# EasyEDA Pro project ProPrj_tp4056 charger_2026-03-09.epro

# Schematic Schematic1
Board Name: Board1; Create Date: 2026-02-10; Page Name: P1; Project Name: tp4056 charger; Schematic Name: Schematic1; Update Date: 2026-02-09; Company: EasyEDA.com; Page Size: A4; Version: V1.0
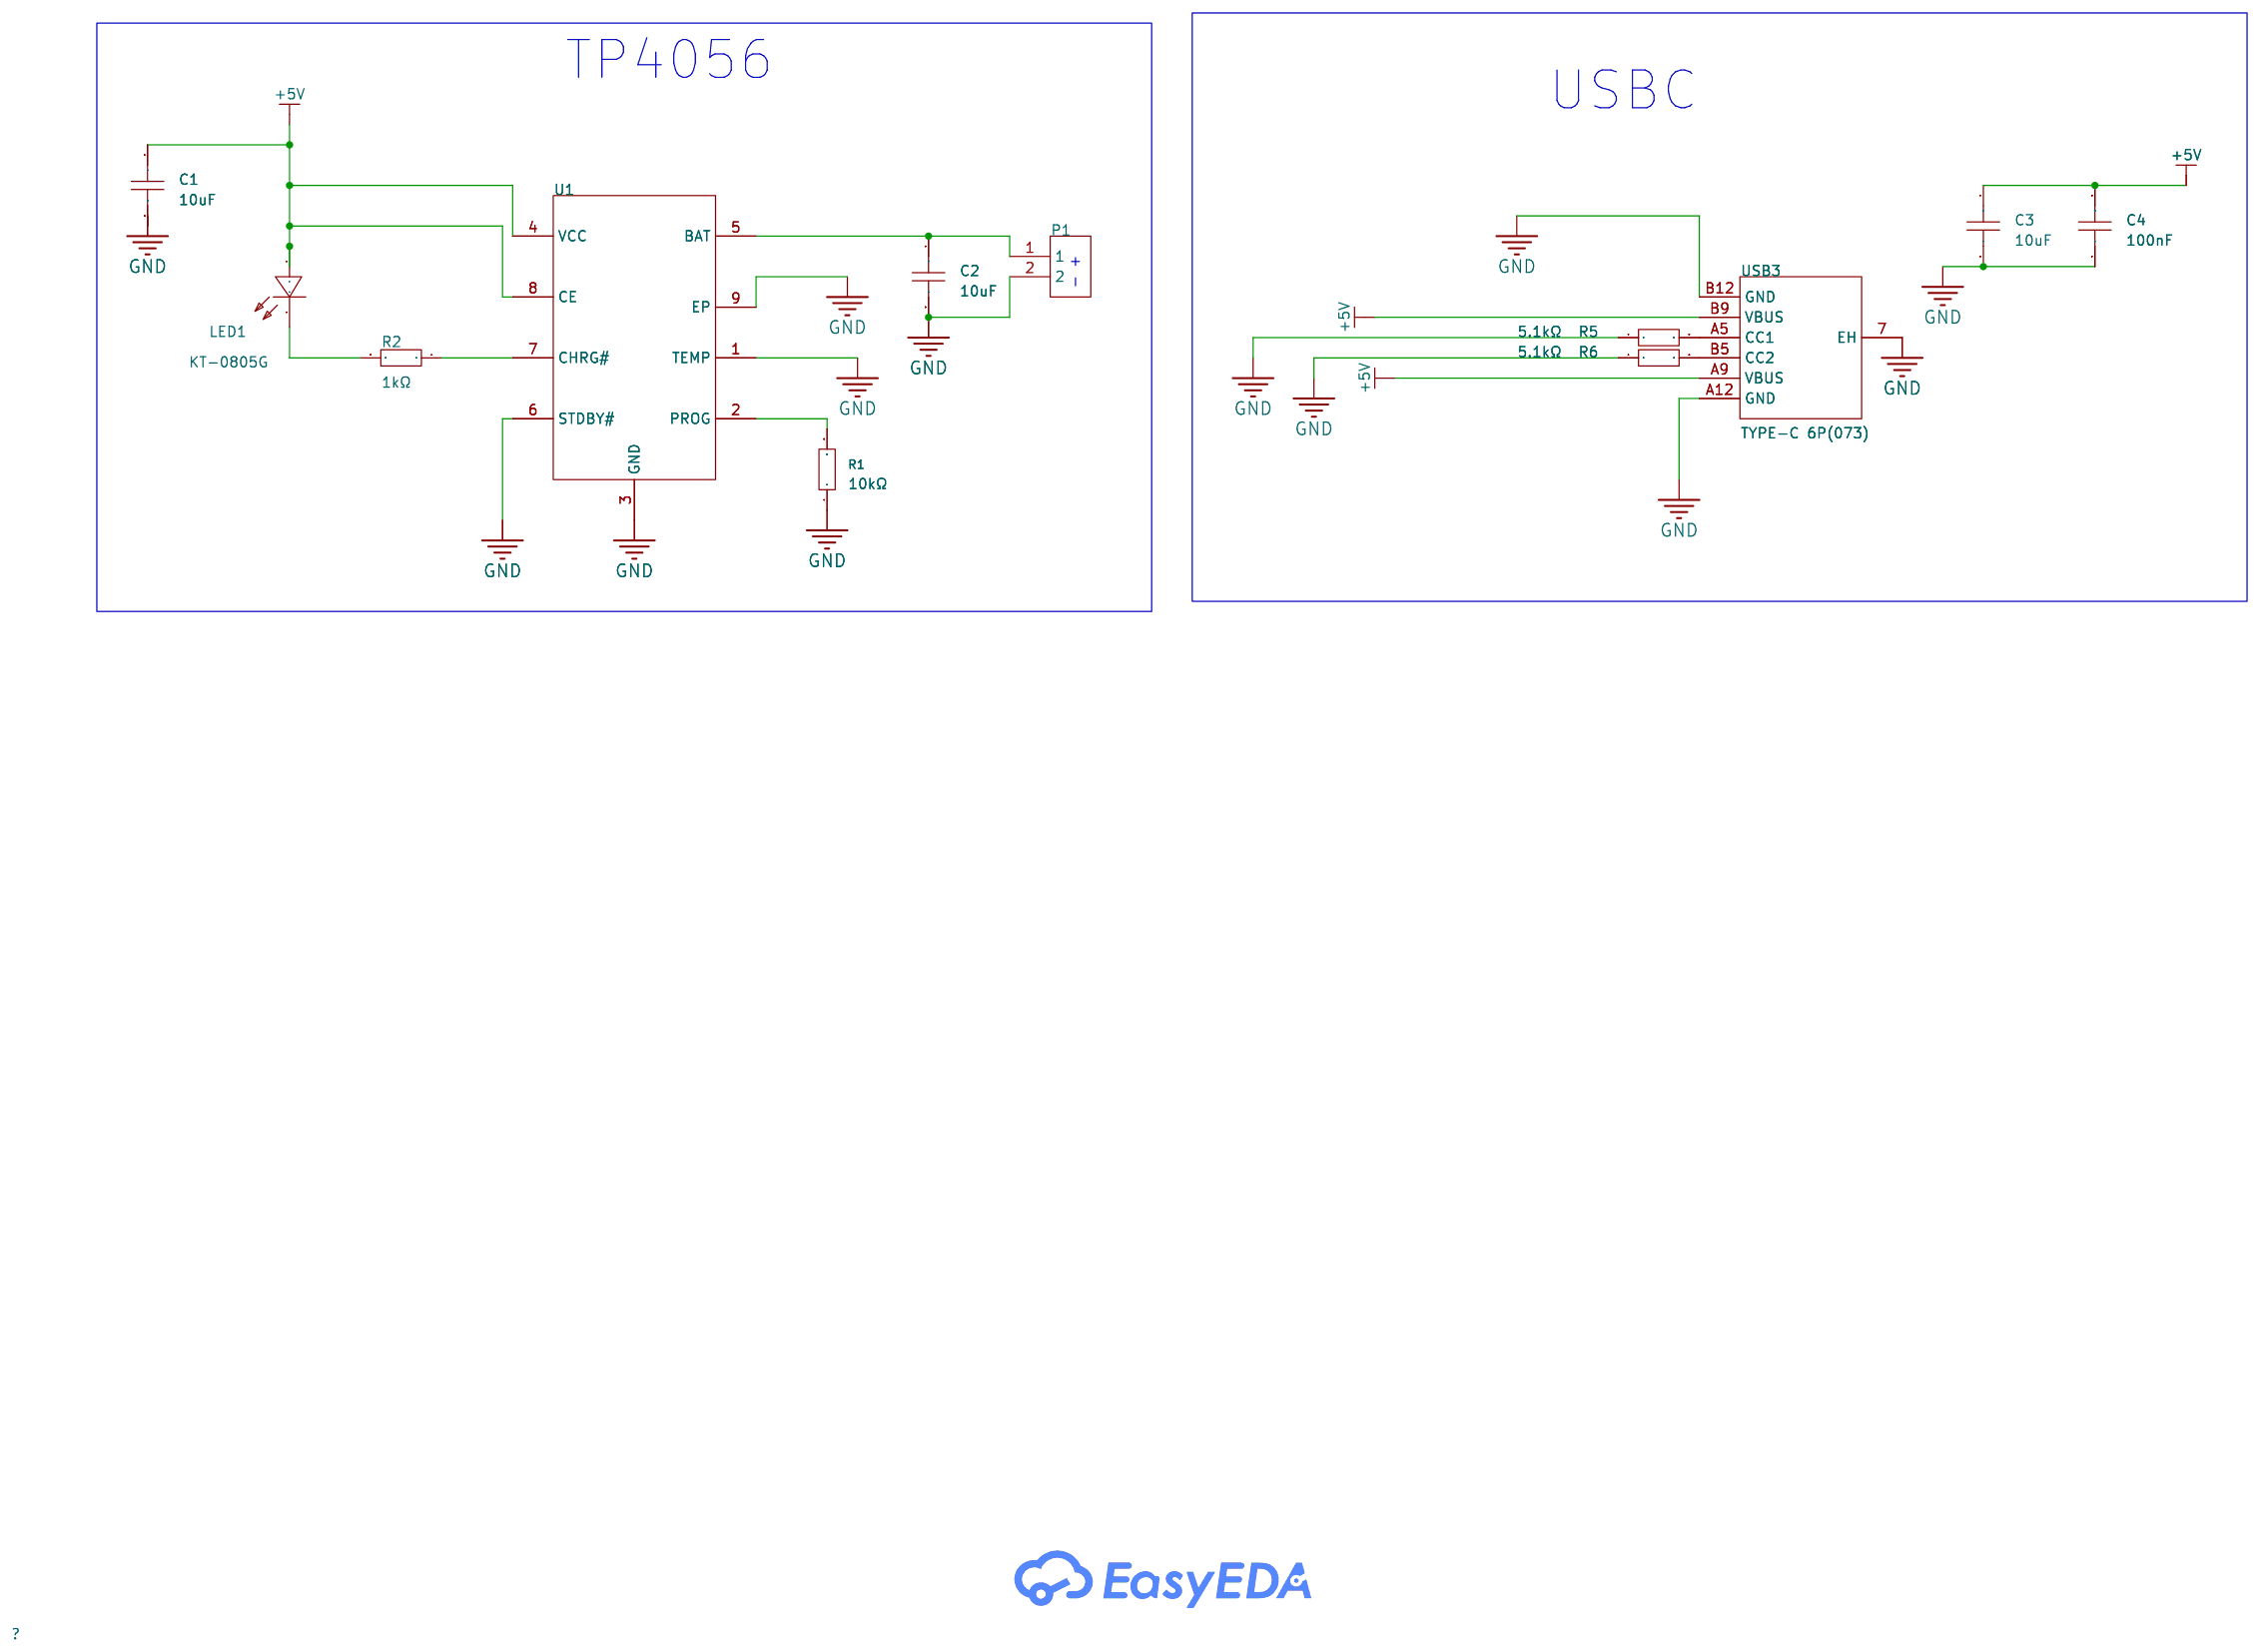
[diagram p0: schematic sheet]

## Parts
C1  10uF  [C0805]
C2  10uF  [C0805]
C3  10uF  [C0805]
C4  100nF  [C0402]
LED1  KT-0805G  [LED0805-R-RD]
P1  WJ301V-5.0-02P-12-00A  [CONN-TH_2P-P5.00_WJ301V-5.00-2P]
R1  10kΩ  [R1206]
R2  1kΩ  [R0402]
R5  5.1kΩ  [R0603]
R6  5.1kΩ  [R0603]
U1  TP4056-42-ESOP8  [ESOP-8_L4.9-W3.9-P1.27-LS6.0-BL-EP]
USB3  TYPE-C 6P(073)  [TYPE-C-SMD_TYPE-C-6P-073]

## Library data of the parts
C1-C3 = CL21A106KAYNNNE_C15850: Capacitance:10uF Tolerance:±10% Tolerance:±10% Voltage Rating:25V Temperature Coefficient:X5R; LCSC Part Name: 10uF ±10% 25V; Supplier Part: C15850; Manufacturer: SAMSUNG(三星); Manufacturer Part: CL21A106KAYNNNE; Supplier Footprint: 0805; JLCPCB Part Class: Basic Part; Datasheet: https://item.szlcsc.com/datasheet/CL21A106KAYNNNE/16532.html; Supplier: LCSC; Tolerance: ±10%; Voltage Rating: 25V; Temperature Coefficient: X5R
C4 = CL05B104KO5NNNC: Capacitance:100nF Tolerance:±10% Tolerance:±10% Voltage Rating:16V Temperature Coefficient:X7R; LCSC Part Name: 100nF ±10% 16V; Supplier Part: C1525; Manufacturer: SAMSUNG(三星); Supplier Footprint: 0402; JLCPCB Part Class: Basic Part; Datasheet: https://item.szlcsc.com/datasheet/CL05B104KO5NNNC/1877.html; Supplier: LCSC; Tolerance: ±10%; Voltage Rating: 16V; Temperature Coefficient: X7R
LED1 = KT-0805G: Lamp Holder Type:- Illumination Color:Emerald Green Voltage - Forward(Vf):2.6V~3.1V Voltage - Forward(Vf):2.6V~3.1V Power(Watts):100mW Forward Current:5mA Wavelength - Dominant:513nm~528nm Wavelength - Dominant:513nm~528nm Peak Wavelength:525nm Diode Conf; LCSC Part Name: 0805 翠绿 高亮; Supplier Part: C2297; Manufacturer: KENTO; Supplier Footprint: 0805; JLCPCB Part Class: Basic Part; Datasheet: https://item.szlcsc.com/datasheet/KT-0805G/2670.html; Supplier: LCSC; Illumination Color: Emerald Green; Voltage - Forward(Vf): 2.6V~3.1V; Power(Watts): 100mW; Forward Current: 5mA; Wavelength - Dominant: 513nm~528nm; Peak Wavelength: 525nm; Luminous Intensity: 430mcd; Viewing Angle: 120°; Operating Temperature: -40℃~+85℃
P1 = WJ301V-5.0-02P-12-00A: Number of Positions or Pins:1x2P Pitch:5mm Color:Blue Mounting Type:Through Hole Number of Pins:2P Number of Rows:1 Number of PINs Per Row:2 Current Rating:17.5A Voltage Rating (Max):250V Wire Gauge - AWG:14~22 Wire Gauge - mm2:1.5 Wire Gauge - mm2:1.5 Op; LCSC Part Name: 5mm 1x2P 排数:1 每排P数:2 直插; Supplier Part: C8475; Manufacturer: KANGNEX(康奈克斯电气); Supplier Footprint: 插件,P=5mm; JLCPCB Part Class: Extended Part; Datasheet: https://item.szlcsc.com/datasheet/WJ301V-5.0-02P-12-00A/8969.html; Supplier: LCSC; Number of Positions or Pins: 1x2P; Pitch: 5mm; Color: Blue; Mounting Type: Through Hole; Number of Pins: 2P; Number of Rows: 1; Number of PINs Per Row: 2; Current Rating: 17.5A; Voltage Rating (Max): 250V; Wire Gauge - AWG: 14~22; Wire Gauge - mm2: 1.5; Operating Temperature: -30℃~+120℃
R1 = 1206W4F1002T5E: Type:Thick Film Resistor Resistance:10kΩ Tolerance:±1% Tolerance:±1% Power(Watts):250mW Voltage-Supply(Max):200V Temperature Coefficient:±100ppm/℃ Temperature Coefficient:±100ppm/℃ Operating Temperature:-55℃~+155℃ Operating Temperature:-55℃~+155℃; LCSC Part Name: 10kΩ ±1% 250mW 厚膜电阻; Supplier Part: C17902; Manufacturer: UNI-ROYAL(厚声); Supplier Footprint: 1206; JLCPCB Part Class: Basic Part; Datasheet: https://item.szlcsc.com/datasheet/1206W4F1002T5E/18590.html; Supplier: LCSC; Type: Thick Film Resistor; Tolerance: ±1%; Power(Watts): 250mW; Voltage-Supply(Max): 200V; Temperature Coefficient: ±100ppm/℃; Operating Temperature: -55℃~+155℃
R2 = 0402WGF1001TCE: Type:Thick Film Resistor Resistance:1kΩ Tolerance:±1% Tolerance:±1% Power(Watts):62.5mW Voltage-Supply(Max):50V Temperature Coefficient:±100ppm/℃ Temperature Coefficient:±100ppm/℃ Operating Temperature:-55℃~+155℃ Operating Temperature:-55℃~+155℃; LCSC Part Name: 1kΩ ±1% 62.5mW 厚膜电阻; Supplier Part: C11702; Manufacturer: UNI-ROYAL(厚声); Supplier Footprint: 0402; JLCPCB Part Class: Basic Part; Datasheet: https://item.szlcsc.com/datasheet/0402WGF1001TCE/12256.html; Supplier: LCSC; Type: Thick Film Resistor; Tolerance: ±1%; Power(Watts): 62.5mW; Voltage-Supply(Max): 50V; Temperature Coefficient: ±100ppm/℃; Operating Temperature: -55℃~+155℃
R5 R6 = 0603WAF5101T5E: Type:Thick Film Resistor Resistance:5.1kΩ Tolerance:±1% Tolerance:±1% Power(Watts):100mW Voltage-Supply(Max):75V Temperature Coefficient:±100ppm/℃ Temperature Coefficient:±100ppm/℃ Operating Temperature:-55℃~+155℃ Operating Temperature:-55℃~+155℃; LCSC Part Name: 5.1kΩ ±1% 100mW 厚膜电阻; Supplier Part: C23186; Manufacturer: UNI-ROYAL(厚声); Supplier Footprint: 0603; JLCPCB Part Class: Basic Part; Datasheet: https://item.szlcsc.com/datasheet/0603WAF5101T5E/23913.html; Supplier: LCSC; Type: Thick Film Resistor; Tolerance: ±1%; Power(Watts): 100mW; Voltage-Supply(Max): 75V; Temperature Coefficient: ±100ppm/℃; Operating Temperature: -55℃~+155℃
U1 = TP4056-42-ESOP8: The Chip Type:Charging IC Voltage - Supply:4V~8V Voltage - Supply:4V~8V Charge Current - Max:1A Charging Saturation Voltage:4.2V End-Off Voltage:- Type of Battery:Lithium Battery Number of Cells:1 Number of Cells:1 Operating Temperature:-40℃~+85℃ Operatin; LCSC Part Name: 1A线性锂离子电池充电器; Supplier Part: C16581; Manufacturer: TOPPOWER(南京拓微); Supplier Footprint: ESOP-8; JLCPCB Part Class: Extended Part; Datasheet: https://item.szlcsc.com/datasheet/TP4056-42-ESOP8/17264.html; Supplier: LCSC; The Chip Type: Charging IC; Voltage - Supply: 4V~8V; Charge Current - Max: 1A; Charging Saturation Voltage: 4.2V; Type of Battery: Lithium Battery; Number of Cells: 1; Operating Temperature: -40℃~+85℃; Battery Temperature Detection: Support; Supply Current (Iq): 2uA
USB3 = TYPE-C 6P(073): Connector Type:Type-C Protocol Standard:- Gender:Female Mounting Type:Surface Mount, Right Angle Number of Contacts:6P Number of Ports:1 Current Rating-Power:3A Voltage Rating:5V Connect-Disconnect Life:10,000 Cycles Supplementary Features:- Center Height; LCSC Part Name: 6P卧贴母座; Supplier Part: C668623; Manufacturer: SHOU HAN(首韩); Supplier Footprint: SMD; JLCPCB Part Class: Extended Part; Datasheet: https://item.szlcsc.com/datasheet/TYPE-C%25206P(073)/698566.html; Supplier: LCSC; Connector Type: Type-C; Gender: Female; Mounting Type: Surface Mount, Right Angle; Number of Contacts: 6P; Number of Ports: 1; Current Rating-Power: 3A; Voltage Rating: 5V; Connect-Disconnect Life: 10,000 Cycles; Detection color: Black; Operating Temperature: -25℃~+85℃

## Nets
+5V: C1.1 C3.1 C4.2 LED1.1(A) U1.4(VCC) U1.8(CE) USB3.A9(VBUS) USB3.B9(VBUS)
GND: C1.2 C2.2 C3.2 C4.1 P1.2 R1.1 R5.1 R6.1 U1.1(TEMP) U1.3(GND) U1.6(STDBY#) U1.9(EP) USB3.7(EH) USB3.A12(GND) USB3.B12(GND)
$1N543: R1.2 U1.2(PROG)
$1N770: LED1.2(K) R2.2
$1N1102: C2.1 P1.1 U1.5(BAT)
$1N1172: R2.1 U1.7(CHRG#)
$1N2801: R5.2 USB3.A5(CC1)
$1N2840: R6.2 USB3.B5(CC2)

## Notes on the sheet
- TP4056
- USBC
- - +

# Board PCB1
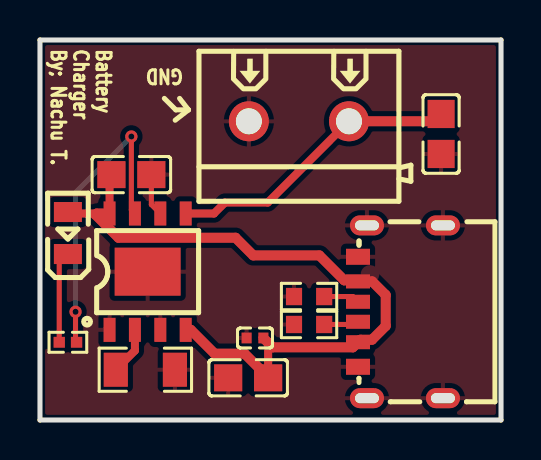
[diagram p1: board, top side]
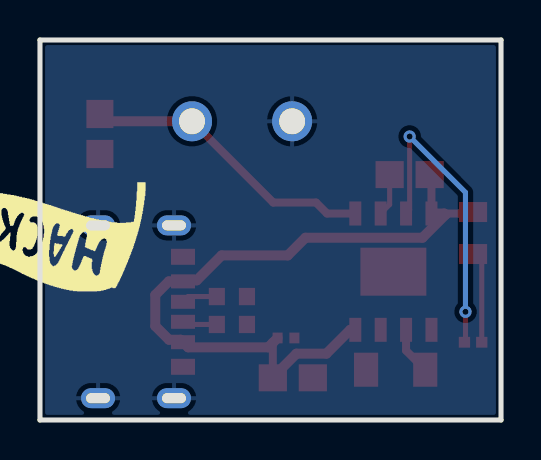
[diagram p2: board, bottom side, seen from below]

Outline 23.06 x 19 mm; copper layers: Top Layer, Bottom Layer. Coordinates in mm from the lower left corner of the outline.
Outline path: 0,19 0,0 23.06,0 23.06,19 0,19
Stack: Top Layer 0.035mm / Dielectric1 1.51mm FR4 er 4.5 / Bottom Layer 0.035mm

## Design rules (mm)
template: JLCPCB Capability(Two Layers Board)
spacing copperThickness1oz (default): track to track 0.102, other pairs 0.152 to 0.3
spacing copperThickness2oz: track to track 0.203, other pairs 0.152 to 0.3
track width copperThickness1oz (default): min 0.127, default 0.254, max 2.54
track width copperThickness2oz: min 0.203, default 0.254, max 2.54
differential pair differentialPair (default): width min 0.127, default 0.254, max 2.54; gap min 0.152, default 0.152
via viaSize (default): diameter min 0.5, default 0.61, max 10; hole min 0.3, default 0.305, max 6.3

## Placement (name value [footprint] x y rotation side)
C1  10uF  [C0805]  4.57 12.27 0 top
C2  10uF  [C0805]  20.07 14.3 270 top
C3  10uF  [C0805]  10.41 2.11 180 top
C4  100nF  [C0402]  10.76 4.1 0 top
LED1  KT-0805G  [LED0805-R-RD]  1.4 9.35 90 top
P1  WJ301V-5.0-02P-12-00A  [CONN-TH_2P-P5.00_WJ301V-5.00-2P]  12.95 14.94 180 top
R1  10kΩ  [R1206]  5.27 2.51 180 top
R2  1kΩ  [R0402]  1.4 3.89 180 top
R5  5.1kΩ  [R0603]  13.46 4.78 0 top
R6  5.1kΩ  [R0603]  13.46 6.17 0 top
U1  TP4056-42-ESOP8  [ESOP-8_L4.9-W3.9-P1.27-LS6.0-BL-EP]  5.39 7.42 0 top
USB3  TYPE-C 6P(073)  [TYPE-C-SMD_TYPE-C-6P-073]  18.03 5.41 90 top

## Footprints (pads in the part's own frame, mm; a bottom-side part is the same pattern mirrored in y, then rotated)
C0402
  rect 0.5x0.54 smd: 1(-0.42,0) 2(0.42,0)
C0805
  rect 1.41x1.35 smd: 1(-1,0) 2(1,0)
CONN-TH_2P-P5.00_WJ301V-5.00-2P
  round 2 hole 1.3: 1(-2.505,0) 2(2.505,0)
ESOP-8_L4.9-W3.9-P1.27-LS6.0-BL-EP
  rect 0.6x1.2 smd: 1(-1.905,-2.909) 2(-0.635,-2.909) 3(0.635,-2.909) 4(1.905,-2.909) 5(1.905,2.909) 6(0.635,2.909) 7(-0.635,2.909) 8(-1.905,2.909)
  rect 3.3x2.4 smd: 9(0,0)
LED0805-R-RD
  rect 1x1.399 smd: 1(1.05,0) 2(-1.05,0)
R0402
  rect 0.566x0.54 smd: 1(-0.433,0) 2(0.433,0)
R0603
  rect 0.806x0.864 smd: 1(-0.753,0) 2(0.753,0)
R1206
  rect 1.208x1.701 smd: 1(-1.479,0) 2(1.479,0)
TYPE-C-SMD_TYPE-C-6P-073
  oval 1x1.7 hole 0.5x1.2: 7(-4.32,1.675) 7(-4.32,-2.125) 7(4.32,1.675) 7(4.32,-2.125)
  rect 0.7x1.2 smd: A5(-0.5,2.125) A9(1.52,2.125) B5(0.5,2.125) B9(-1.52,2.125)
  rect 0.8x1.2 smd: A12(2.75,2.125) B12(-2.75,2.125)

## Nets
As in the schematic.

## Via types
v1: diameter 0.61, hole 0.305, Top Layer to Bottom Layer, 2 vias

## Routing (per net, layer and track width the routed paths; a pad name or vN(x,y) marks a point on that pad's centre or on a via; arc(x,y) is an arc through that point)
+5V: length 35.5
  Top Layer w0.4: C1.1 3.48,12.18 U1.8 ; 2.84,10.32 1.47,10.32 LED1.1 ; 11.41,2.14 11.41,3.86
  Top Layer w0.5: C4.2 11.65,3.63 15.65,3.63 USB3.B9 16.03,4.01 16.61,4.01 17.3,4.7 17.3,6.25 16.62,6.93 USB3.A9 15.86,6.98 15.22,6.98 13.98,8.23 10.67,8.23 9.78,9.11 3.93,9.11 2.78,10.26 2.84,10.32 U1.8 ; C3.1 11.41,2.14 10.23,3.32 8.74,3.32 7.54,4.51 U1.4
GND: length 2.1
  Top Layer w0.254: U1.6 5.57,10.77 C1.2
$1N543: length 2.4
  Top Layer w0.4: U1.2 4.75,3.47 3.79,2.51
$1N770: length 4.6
  Top Layer w0.254: R2.2 0.96,7.86 LED1.2
$1N1102: length 14.8
  Top Layer w0.4: U1.5 8.71,10.32 9.25,10.87 11.39,10.87 P1.1
  Top Layer w0.5: C2.1 19.7,14.94 P1.1
$1N1172: length 15.4
  Top Layer w0.254: v1(4.57,14.17) 4.57,10.5 U1.7 ; R2.1 1.78,3.94 v1(1.78,5.41)
  Bottom Layer w0.254: v1(1.78,5.41) 1.78,11.38 v1(4.57,14.17)
$1N2801: length 1.7
  Top Layer w0.254: USB3.A5 15.77,4.78 R5.2
$1N2840: length 1.8
  Top Layer w0.254: R6.2 15.65,6.17 USB3.B5

## Copper pours and planes (outline as drawn; the poured copper is in the pictures)
GND on Top Layer: -2.41,19.63 28.45,19.63 28.45,-3.73 -2.41,-3.73
GND on Bottom Layer: -5.97,22.05 32.13,22.05 32.13,-8.43 -5.97,-8.43

## Text on the board
Top Silkscreen Layer: GND | Battery / Charger / By; Nachu T.
